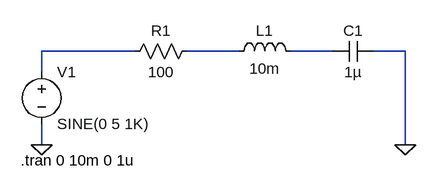
[diagram p0: schematic RLC_CIRCUIT.asc.asc]
RLC_CIRCUIT.asc.asc, the LTspice schematic file:
Version 4.1
SHEET 1 880 680
WIRE 128 96 -16 96
WIRE 288 96 208 96
WIRE 432 96 368 96
WIRE 544 96 496 96
WIRE -16 128 -16 96
WIRE -16 240 -16 208
WIRE 544 240 544 96
FLAG -16 240 0
FLAG 544 240 0
SYMBOL voltage -16 112 R0
SYMATTR InstName V1
SYMATTR Value SINE(0 5 1K)
SYMBOL res 112 112 R270
WINDOW 0 32 56 VTop 2
WINDOW 3 0 56 VBottom 2
SYMATTR InstName R1
SYMATTR Value 100
SYMBOL ind 272 112 R270
WINDOW 0 32 56 VTop 2
WINDOW 3 5 56 VBottom 2
SYMATTR InstName L1
SYMATTR Value 10m
SYMATTR SpiceLine Rser=1m
SYMBOL cap 432 112 R270
WINDOW 0 32 32 VTop 2
WINDOW 3 0 32 VBottom 2
SYMATTR InstName C1
SYMATTR Value 1µ
TEXT -48 264 Left 2 !.tran 0 10m 0 1u

The netlist it stands for:
* RLC_CIRCUIT.asc.asc
V1 N001 0 SINE(0 5 1K)
R1 N001 N002 100
L1 N002 N003 10m Rser=1m
C1 N003 0 1µ
.tran 0 10m 0 1u
.backanno
.end